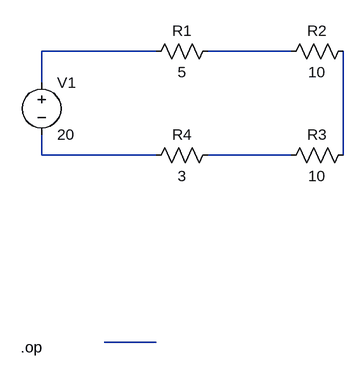
[diagram p0: schematic circuit.asc]
circuit.asc, the LTspice schematic file:
Version 4.1
SHEET 1 880 680
WIRE 176 -16 0 -16
WIRE 384 -16 256 -16
WIRE 0 32 0 -16
WIRE 0 144 0 112
WIRE 176 144 0 144
WIRE 384 144 256 144
WIRE 464 144 464 -16
WIRE 176 432 96 432
DATAFLAG 96 -16 ""
DATAFLAG 304 -16 ""
DATAFLAG 464 32 ""
DATAFLAG 336 144 ""
DATAFLAG 64 144 ""
SYMBOL res 272 -32 R90
WINDOW 0 0 56 VBottom 2
WINDOW 3 32 56 VTop 2
SYMATTR InstName R1
SYMATTR Value 5
SYMBOL res 480 -32 R90
WINDOW 0 0 56 VBottom 2
WINDOW 3 32 56 VTop 2
SYMATTR InstName R2
SYMATTR Value 10
SYMBOL res 480 128 R90
WINDOW 0 0 56 VBottom 2
WINDOW 3 32 56 VTop 2
SYMATTR InstName R3
SYMATTR Value 10
SYMBOL res 272 128 R90
WINDOW 0 0 56 VBottom 2
WINDOW 3 32 56 VTop 2
SYMATTR InstName R4
SYMATTR Value 3
SYMBOL voltage 0 16 R0
SYMATTR InstName V1
SYMATTR Value 20
TEXT -32 440 Left 2 !.op

The netlist it stands for:
* circuit.asc
R1 N002 N001 5
R2 N005 N002 10
R3 N005 N004 10
R4 N004 N003 3
V1 N001 N003 20
.op
.backanno
.end